# EAGLE design Wiiext-NES Mini-SNES Mini (EAGLE 9.6.2)
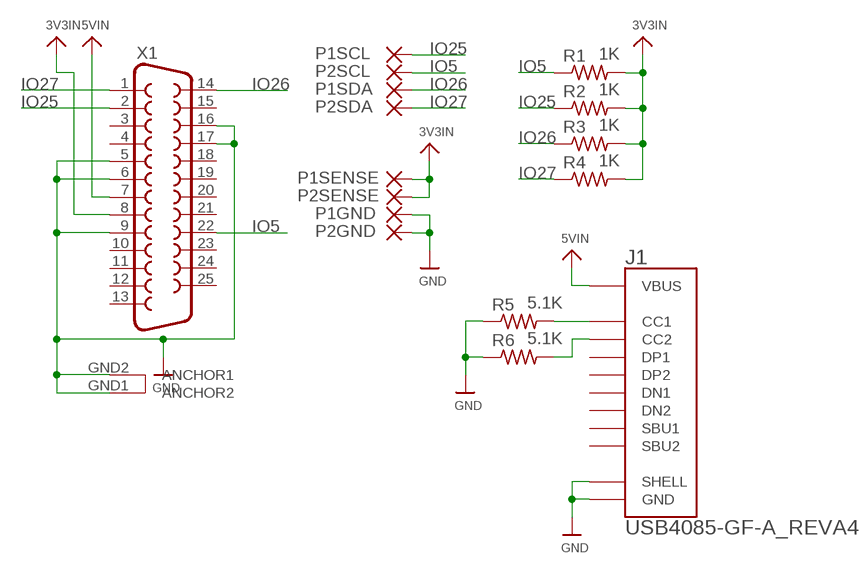
[diagram p0: schematic, sheet 1]

## Parts
J1  USB4085-GF-A_REVA4  [GCT_USB4085-GF-A_REVA4]
P1GND  SMD5  [SMD2,54-5,08]
P1SCL  SMD5  [SMD2,54-5,08]
P1SDA  SMD5  [SMD2,54-5,08]
P1SENSE  SMD5  [SMD2,54-5,08]
P2GND  SMD5  [SMD2,54-5,08]
P2SCL  SMD5  [SMD2,54-5,08]
P2SDA  SMD5  [SMD2,54-5,08]
P2SENSE  SMD5  [SMD2,54-5,08]
R1  1K  R-US_R1206  [R1206]
R2  1K  R-US_R1206  [R1206]
R3  1K  R-US_R1206  [R1206]
R4  1K  R-US_R1206  [R1206]
R5  5.1K  R-US_R1206  [R1206]
R6  5.1K  R-US_R1206  [R1206]
X1  DB25_FEMALEHP  [F25HP]

## Nets
3V3IN: P1SENSE.1(P) P2SENSE.1(P) R1.2 R2.2 R3.2 R4.2 X1.8
5VIN: J1.A4(VBUS) J1.A9(VBUS) J1.B4(VBUS) J1.B9(VBUS) X1.7
GND: J1.A1(GND) J1.A12(GND) J1.B1(GND) J1.B12(GND) J1.S1(SHELL) J1.S2(SHELL) J1.S3(SHELL) J1.S4(SHELL) P1GND.1(P) P2GND.1(P) R5.1 R6.1 X1.5 X1.6 X1.9 X1.16 X1.17 X1.GND1(ANCHOR2) X1.GND2(ANCHOR1)
IO5: P2SCL.1(P) R1.1 X1.22
IO25: P1SCL.1(P) R2.1 X1.2
IO26: P1SDA.1(P) R3.1 X1.14
IO27: P2SDA.1(P) R4.1 X1.1
PD1: J1.B5(CC2) R6.2
PD2: J1.A5(CC1) R5.2
Unconnected: J1.A6(DP1) J1.A7(DN1) J1.A8(SBU1) J1.B6(DP2) J1.B7(DN2) J1.B8(SBU2) X1.3 X1.4 X1.10 X1.11 X1.12 X1.13 X1.15 X1.18 X1.19 X1.20 X1.21 X1.23 X1.24 X1.25

## Library data of the parts
J1 = USB4085-GF-A_REVA4:USB4085-GF-A_REVA4; DESCRIPTION: USB-C (USB TYPE-C) USB 2.0 Receptacle Connector 24 (16+8 Dummy) Position Through Hole, Right Angle, low cost, 3.46mm profile, 16 pin, horizontal, Top mount; DIGI-KEY_PART_NUMBER: 2073-USB4085-GF-ATR-ND; MF: Global Connector Technology; MP: USB4085-GF-A; PACKAGE: None; PURCHASE-URL: https://pricing.snapeda.com/search/part/USB4085-GF-A/?ref=eda
P1GND P1SCL P1SDA P1SENSE P2GND P2SCL P2SDA P2SENSE = wirepad:SMD5: SMD PAD
R1-R6 = adafruit:R-US_: RESISTOR, American symbol
X1 = SparkFun-Retired:DB25_FEMALE: 25 Pin male connector. PCB edge mount for regular PCB thicknesses. This connector will connect directly to the back of a PC parallel port or through a normal DB25 extension cable (M/F). SKU: PRT-08287

## Board
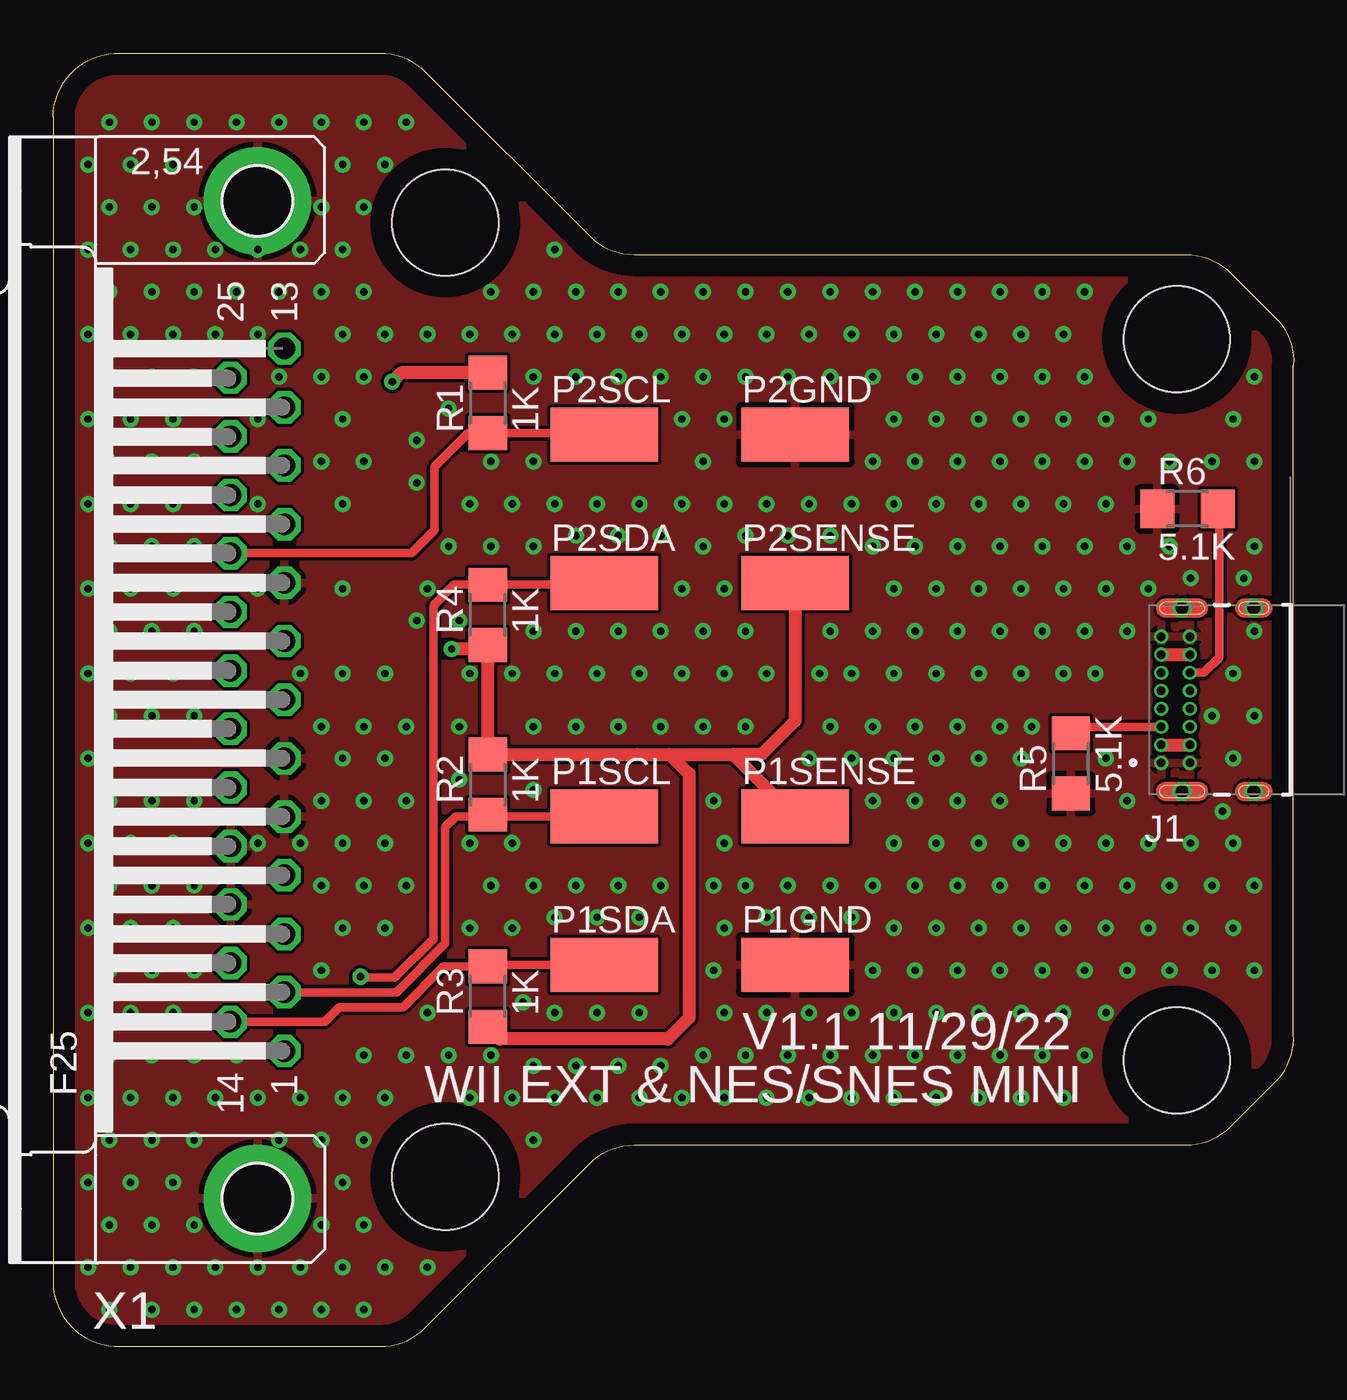
[diagram p1: board, top side]
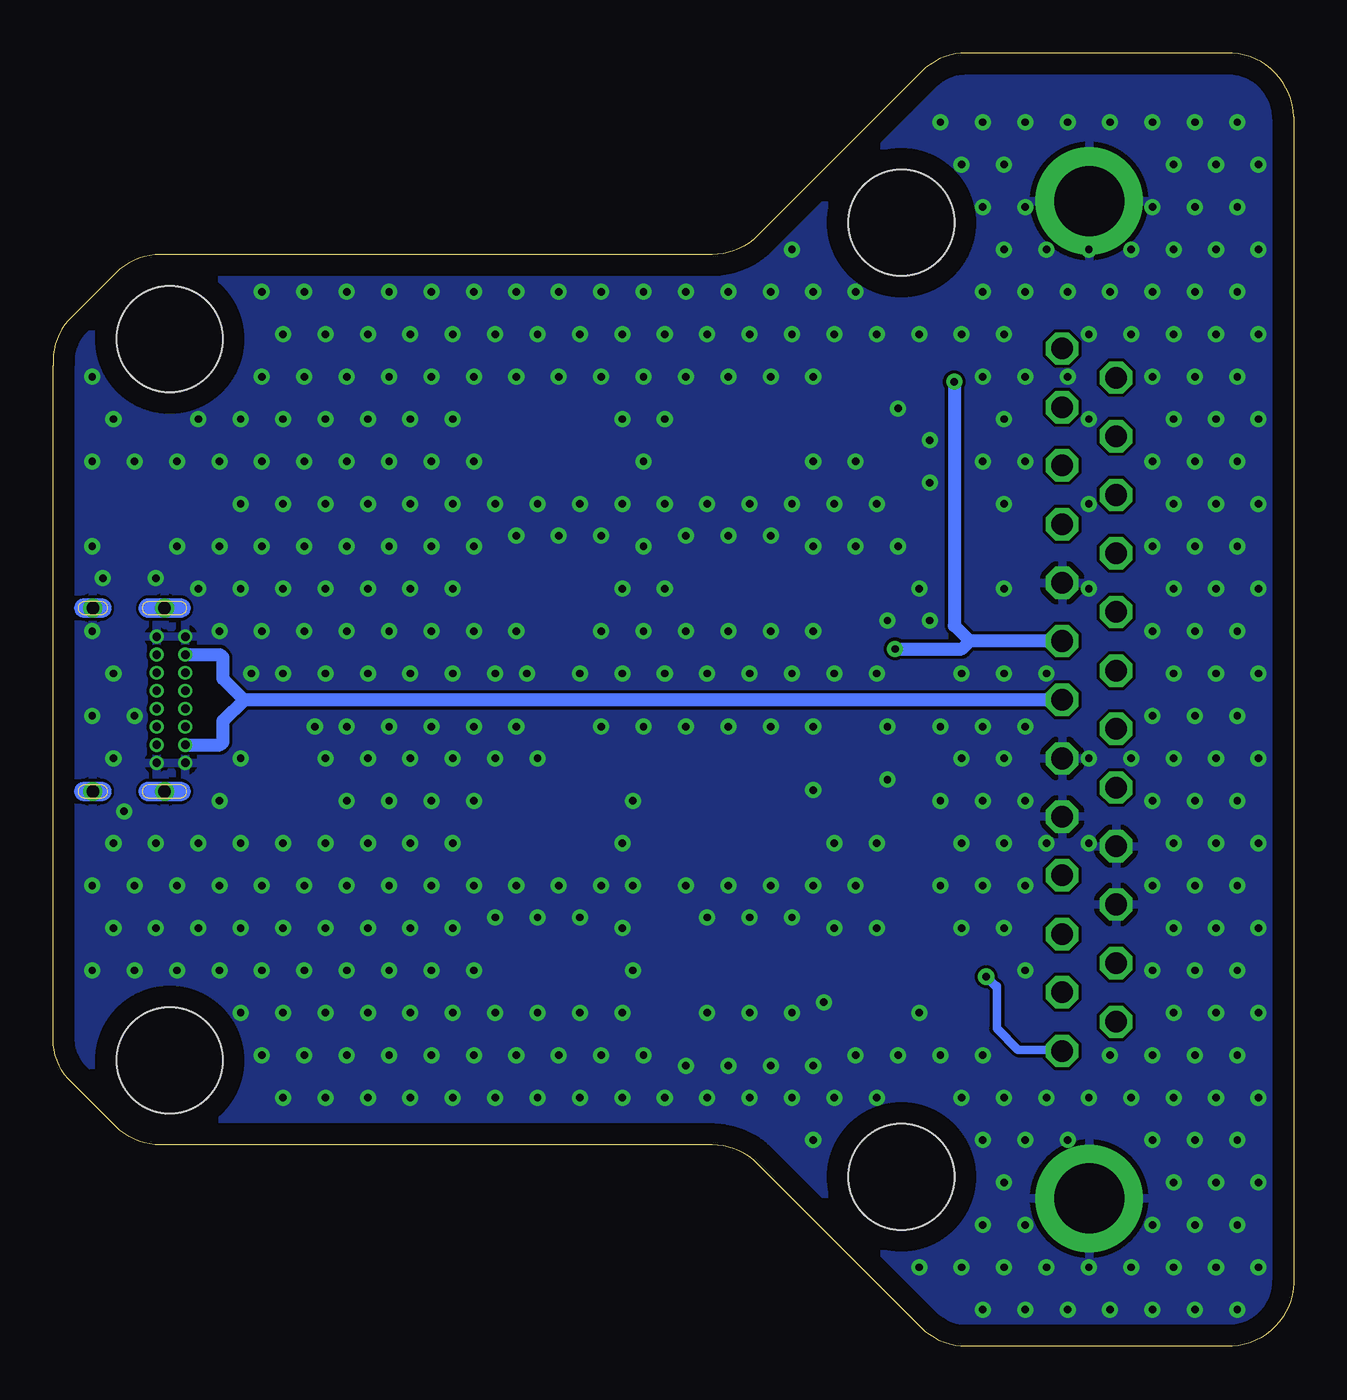
[diagram p2: board, bottom side, seen from below]

Size 58.51 x 61 mm. Coordinates in mm from the lower left corner, seen from the top.
Outline: 0,58 0,3 arc90 3.17,0 15.43,0 arc45 17.55,0.88 25.29,8.62 arc-45 27.41,9.5 53.43,9.5 arc45 55.55,10.38 57.79,12.62 arc45 58.5,14.74 58.5,46.26 arc45 57.79,48.38 55.55,50.62 arc45 53.43,51.5 27.41,51.5 arc-45 25.29,52.38 17.55,60.12 arc45 15.43,61 3.17,61 arc90 0,58
Copper layers (1*16): Top 0.035mm / dielectric 1.5mm / Bottom 0.035mm
Design rules "default *": minimum track width 6mil, minimum drill 0.35mm, track to track 6mil, track to pad 6mil, pad to pad 6mil, via to via 6mil, smd to smd 6mil, copper to edge 40mil, drill to drill 6mil, minimum pad ring 5mil, minimum via ring 8mil, stop-mask expansion 4mil, vias tented up to drill 0.5mm, thermal gap 10mil
Holes 5 mm at 53,13.5 53,47.5 18.5,53 18.5,8

### Footprints (pad centres in the part's own frame; a part is rotated, then mirrored left to right if it is on the bottom)
GCT_USB4085-GF-A_REVA4 = drill 0.4 pad 0.65: A1 -2.975,4.36; A4 -2.125,4.36; A5 -1.275,4.36; A6 -0.425,4.36; A7 0.425,4.36; A8 1.275,4.36; A9 2.125,4.36; A12 2.975,4.36; B1 2.975,3.01; B4 2.125,3.01; B5 1.275,3.01; B6 0.425,3.01; B7 -0.425,3.01; B8 -1.275,3.01; B9 -2.125,3.01; B12 -2.975,3.01 | drill 0.6 pad 0.9: S1 -4.325,0; S2 4.325,0; S3 -4.325,3.38; S4 4.325,3.38
SMD2,54-5,08 = smd 2.54 x 5.08: 1 0,0
R1206 = smd 1.6 x 1.803: 1 -1.422,0; 2 1.422,0
F25HP = drill 1.016 octagon: 1 -16.561,-1.27; 2 -13.792,-1.27; 3 -11.049,-1.27; 4 -8.28,-1.27; 5 -5.512,-1.27; 6 -2.769,-1.27; 7 0,-1.27; 8 2.769,-1.27; 9 5.512,-1.27; 10 8.28,-1.27; 11 11.049,-1.27; 12 13.792,-1.27; 13 16.561,-1.27; 14 -15.189,1.27; 15 -12.421,1.27; 16 -9.652,1.27; 17 -6.909,1.27; 18 -4.14,1.27; 19 -1.372,1.27; 20 1.372,1.27; 21 4.14,1.27; 22 6.909,1.27; 23 9.652,1.27; 24 12.421,1.27; 25 15.189,1.27 | drill 3.302 pad 5.08: GND1 -23.52,0; GND2 23.52,0

### Placement (x,y rotation side)
J1  56.63,30.5 90 top
P1GND  35,18 270 top
P1SCL  26,25 270 top
P1SDA  26,18 270 top
P1SENSE  35,25 270 top
P2GND  35,43 270 top
P2SCL  26,43 270 top
P2SDA  26,36 270 top
P2SENSE  35,36 270 top
R1  20.5,44.5 90 top
R2  20.5,26.5 90 top
R3  20.5,16.5 270 top
R4  20.5,34.5 270 top
R5  48,27.5 90 top
R6  53.5,39.5 0 top
X1  9.64,30.5 90 top

### Tracks (layer width: path | path; a pad name or v marks a point on that pad's centre or on a via)
3V3IN  (via drill 0.35)
  Top 0.61: R1.2 16.42,45.92 v16,45.5 | v18.8,32.89 20.32,32.89 R4.2 R2.2 27.5,27.92 29.08,27.92 | P2SENSE.1 35,29.5 33.42,27.92 32.08,27.92 | 29.08,27.92 32.08,27.92 | 32.08,27.92 P1SENSE.1 | 29.08,27.92 30,27 30,15.5 29,14.5 21.08,14.5 R3.2
  Bottom 0.61: X1.8 15.27,33.27 | 15.27,33.27 16,34 v16,45.5 | v18.8,32.89 15.64,32.89 15.27,33.27
5VIN
  Top 0.61: J1.A4 J1.B9 | J1.A9 J1.B4
  Bottom 0.61: J1.A4 50.62,28.38 50.5,28.5 50.5,29.5 49.5,30.5 | J1.A9 50.62,32.62 50.5,32.5 50.5,31.5 49.5,30.5 | X1.7 49.5,30.5
GND  (via drill 0.35)
  other vias: 2.66,1.74 1.66,3.74 2.66,5.74 1.66,7.74 2.66,9.74 1.66,11.74 2.66,13.74 1.66,15.74 2.66,17.74 1.66,19.74 2.66,21.74 1.66,23.74 2.66,25.74 1.66,27.74 2.66,29.74 1.66,31.74 2.66,33.74 1.66,35.74 2.66,37.74 1.66,39.74 2.66,41.74 1.66,43.74 2.66,45.74 1.66,47.74 2.66,49.74 1.66,51.74 2.66,53.74 1.66,55.74 2.66,57.74 4.66,1.74 3.66,3.74 4.66,5.74 3.66,7.74 4.66,9.74 3.66,11.74 4.66,13.74 3.66,15.74 4.66,17.74 3.66,19.74 4.66,21.74 3.66,23.74 4.66,25.74 3.66,27.74 4.66,29.74 3.66,31.74 4.66,33.74 3.66,35.74 4.66,37.74 3.66,39.74 4.66,41.74 3.66,43.74 4.66,45.74 3.66,47.74 4.66,49.74 3.66,51.74 4.66,53.74 3.66,55.74 4.66,57.74 6.66,1.74 5.66,3.74 6.66,5.74 5.66,7.74 6.66,9.74 5.66,11.74 6.66,13.74 5.66,15.74 6.66,17.74 5.66,19.74 6.66,21.74 5.66,23.74 6.66,25.74 5.66,27.74 6.66,29.74 5.66,31.74 6.66,33.74 5.66,35.74 6.66,37.74 5.66,39.74 6.66,41.74 5.66,43.74 6.66,45.74 5.66,47.74 6.66,49.74 5.66,51.74 6.66,53.74 5.66,55.74 6.66,57.74 8.66,1.74 7.66,3.74 7.66,11.74 8.66,13.74 7.66,27.74 7.66,47.74 8.66,49.74 7.66,51.74 8.66,57.74 10.66,1.74 9.66,3.74 10.66,9.74 9.66,11.74 9.66,23.74 9.66,27.74 9.66,35.74 9.66,39.74 9.66,43.74 10.66,45.74 9.66,47.74 10.66,49.74 9.66,51.74 10.66,57.74 12.66,1.74 11.66,3.74 12.66,5.74 12.66,9.74 11.66,11.74 12.66,17.74 12.66,21.74 11.66,23.74 12.66,25.74 12.66,29.24 11.66,31.74 12.66,41.74 12.66,45.74 12.66,49.74 11.66,51.74 12.66,53.74 12.66,57.74 14.66,1.74 13.66,3.74 14.66,5.74 13.66,7.74 14.66,9.74 13.66,11.74 14.66,13.74 13.66,19.74 14.66,21.74 13.66,23.74 14.66,25.74 13.66,27.74 14.66,29.24 13.66,31.74 13.66,35.74 13.66,39.74 14.66,41.74 13.66,43.74 14.66,45.74 13.66,47.74 14.66,49.74 13.66,51.74 14.66,53.74 13.66,55.74 14.66,57.74 15.66,3.74 15.66,11.74 16.66,13.74 15.66,19.74 16.66,21.74 15.66,23.74 16.66,25.74 15.66,27.74 16.66,29.24 15.66,31.74 17.16,34.24 17.16,40.74 15.66,47.74 15.66,55.74 16.66,57.74 17.66,3.74 18.66,13.74 17.66,15.74 19.16,26.74 19.16,29.24 19.16,34.24 17.66,35.74 18.66,37.74 18.66,44.24 17.66,47.74 19.66,11.74 20.66,13.74 19.66,19.74 20.66,21.74 19.66,23.74 19.66,31.74 20.66,37.74 19.66,39.74 20.66,41.74 19.66,47.74 20.66,49.74 22.66,9.74 21.66,11.74 22.66,13.24 22.16,16.24 21.66,19.74 22.66,21.74 21.66,23.74 22.66,26.24 22.66,29.24 21.66,31.74 22.66,33.74 22.66,37.74 21.66,39.74 22.66,41.74 17.16,42.74 22.66,45.74 21.66,47.74 22.66,49.74 23.66,11.74 24.66,13.24 23.66,15.74 23.66,20.24 24.66,21.74 24.66,29.24 23.66,31.74 24.66,33.74 24.66,38.24 23.66,39.74 24.66,45.74 23.66,47.74 24.66,49.74 23.66,51.74 25.66,11.74 26.66,13.24 25.66,15.74 25.66,20.24 26.66,21.74 26.66,29.24 25.66,31.74 26.66,33.74 26.66,38.24 25.66,39.74 26.66,45.74 25.66,47.74 26.66,49.74 27.66,11.74 28.66,13.24 27.66,15.74 27.66,20.24 28.66,21.74 28.66,29.24 27.66,31.74 28.66,33.74 28.66,38.24 27.66,39.74 28.66,45.74 27.66,47.74 28.66,49.74 29.66,11.74 30.66,13.74 31.16,17.74 31.16,21.74 31.16,25.74 30.66,29.24 29.66,31.74 30.66,33.74 29.66,35.74 30.66,37.74 29.66,39.74 30.66,41.74 29.66,43.74 30.66,45.74 29.66,47.74 30.66,49.74 31.66,11.74 32.66,13.74 31.66,15.74 31.66,19.74 32.66,21.74 31.66,23.74 32.66,29.24 31.66,31.74 32.66,33.74 31.66,35.74 32.66,38.24 31.66,39.74 31.66,43.74 32.66,45.74 31.66,47.74 32.66,49.74 33.66,11.74 34.66,13.74 33.66,15.74 33.66,20.24 34.66,21.74 33.66,31.74 34.66,38.24 33.66,39.74 34.66,45.74 33.66,47.74 34.66,49.74 35.66,11.74 36.66,13.74 35.66,15.74 35.66,20.24 36.66,21.74 35.66,27.74 36.66,29.24 36.16,31.74 36.66,33.74 36.66,38.24 35.66,39.74 36.66,45.74 35.66,47.74 36.66,49.74 37.66,11.74 38.66,13.74 37.66,15.74 38.66,17.74 37.66,20.24 38.66,21.74 38.66,25.74 37.66,27.74 38.66,29.24 37.66,31.74 38.66,33.74 38.66,37.74 37.66,39.74 38.66,41.74 38.66,45.74 37.66,47.74 38.66,49.74 39.66,11.74 40.66,13.74 39.66,15.74 40.66,17.74 39.66,19.74 40.66,21.74 39.66,23.74 40.66,25.74 39.66,27.74 40.66,29.24 39.66,31.74 40.66,33.74 39.66,35.74 40.66,37.74 39.66,39.74 40.66,41.74 39.66,43.74 40.66,45.74 39.66,47.74 40.66,49.74 41.66,11.74 42.66,13.74 41.66,15.74 42.66,17.74 41.66,19.74 42.66,21.74 41.66,23.74 42.66,25.74 41.66,27.74 42.66,29.24 41.66,31.74 42.66,33.74 41.66,35.74 42.66,37.74 41.66,39.74 42.66,41.74 41.66,43.74 42.66,45.74 41.66,47.74 42.66,49.74 43.66,11.74 44.66,13.74 43.66,15.74 44.66,17.74 43.66,19.74 44.66,21.74 43.66,23.74 44.66,25.74 43.66,27.74 44.66,29.24 43.66,31.74 44.66,33.74 43.66,35.74 44.66,37.74 43.66,39.74 44.66,41.74 43.66,43.74 44.66,45.74 43.66,47.74 44.66,49.74 45.66,11.74 46.66,13.74 45.66,15.74 46.66,17.74 45.66,19.74 46.66,21.74 45.66,23.74 45.66,27.74 46.16,29.24 45.66,31.74 46.66,33.74 45.66,35.74 46.66,37.74 45.66,39.74 46.66,41.74 45.66,43.74 46.66,45.74 45.66,47.74 46.66,49.74 47.66,11.74 48.66,13.74 47.66,15.74 48.66,17.74 47.66,19.74 48.66,21.74 47.66,23.74 47.66,31.74 48.66,33.74 47.66,35.74 48.66,37.74 47.66,39.74 48.66,41.74 47.66,43.74 48.66,45.74 47.66,47.74 48.66,49.74 49.66,15.74 50.66,17.74 49.66,19.74 50.66,21.74 49.66,23.74 50.66,25.74 49.66,27.74 49.16,31.74 50.66,33.74 49.66,35.74 50.66,37.74 49.66,39.74 50.66,41.74 49.66,43.74 52.66,17.74 51.66,19.74 52.66,21.74 51.66,23.74 51.66,35.74 52.66,37.74 52.66,41.74 51.66,43.74 54.66,17.74 53.66,19.74 54.66,21.74 53.66,23.74 55.16,25.24 54.66,29.74 53.66,36.24 54.66,41.74 56.66,17.74 55.66,19.74 56.66,21.74 55.66,23.74 55.66,27.74 56.66,29.74 55.66,31.74 56.66,33.74 56.16,36.24 56.66,37.74 56.66,41.74 55.66,43.74 56.66,45.74
  pour Top: 0,0 0,61 28.67,61 28.67,51.5 59.17,51.5 59.17,9.5 28.17,9.5 28.17,0
  pour Bottom: 0,0 0,61 28.67,61 28.67,51.5 59.17,51.5 59.17,9.5 28.17,9.5 28.17,0
IO5
  Top 0.406: X1.22 16.91,37.41 18,38.5 18,41.5 19.58,43.08 R1.1 26.92,43.08 27,43 P2SCL.1
IO25
  Top 0.406: R2.1 20.42,25 | 20.42,25 19,25 18.5,24.5 18.5,19 16.21,16.71 X1.2 | P1SCL.1 20.42,25
IO26
  Top 0.406: X1.14 12.81,15.31 13.5,16 16.5,16 18.42,17.92 R3.1 20.58,18 P1SDA.1
IO27  (via drill 0.35)
  Top 0.406: P2SDA.1 25.92,35.92 R4.1 18.92,35.92 17.94,34.94 17.94,19.23 16.11,17.39 14.55,17.39 v14.5,17.44
  Bottom 0.406: v14.5,17.44 14.06,17 14,17 14,15 13,14 10.97,14 X1.1
PD1
  Top 0.406: R6.2 55,39.42 55,32.5 54.27,31.77 J1.B5
PD2
  Top 0.406: R5.2 48.3,29.23 J1.A5

### Text on the board
tPlace: WII EXT & NES/SNES MINI
tNames: V1.1 11/29/22